# EAGLE design Robot_HC-SR04v1 (EAGLE 6.4)
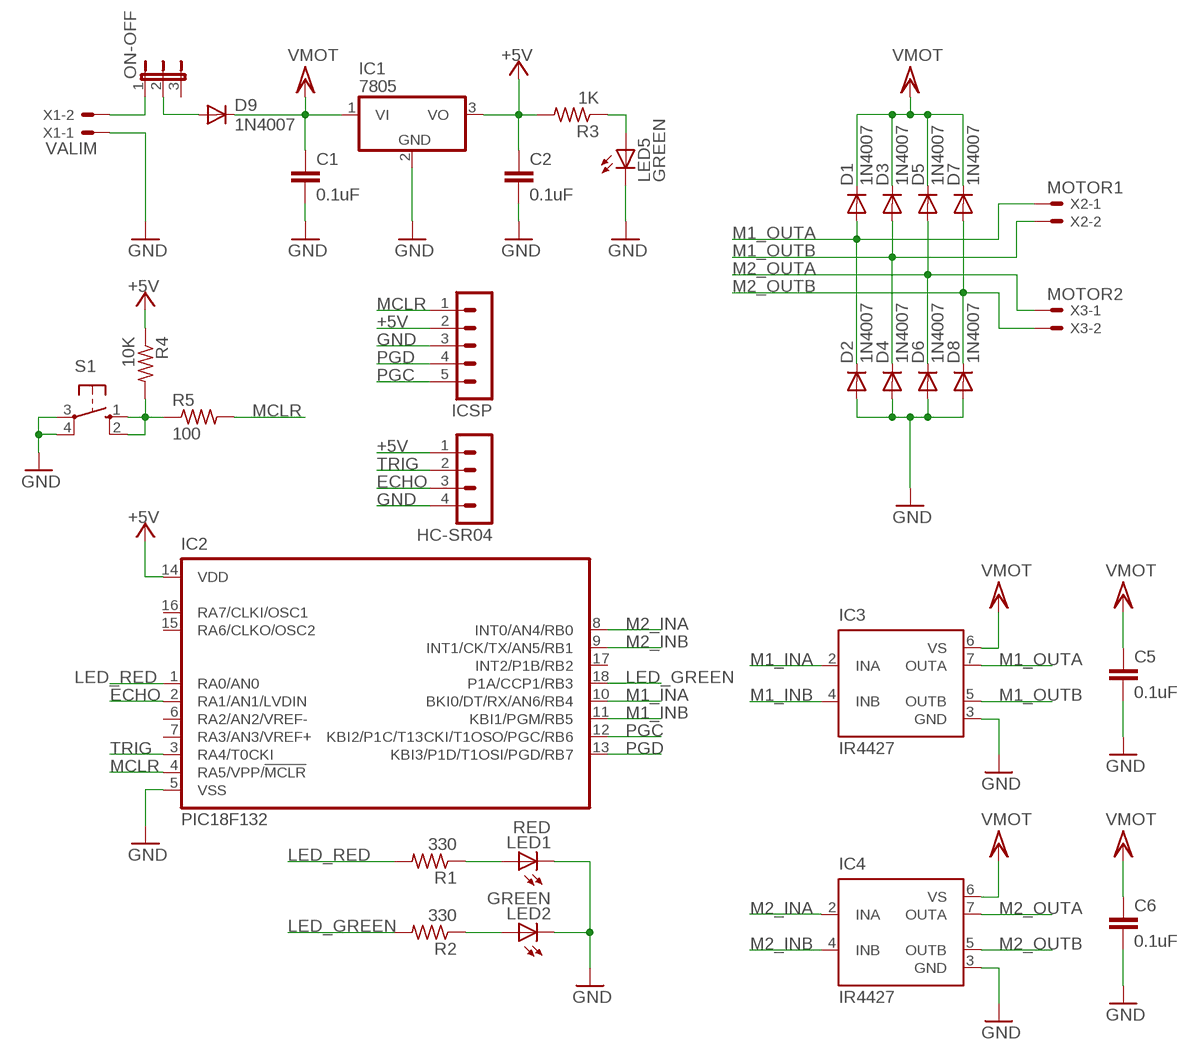
[diagram p0: schematic, sheet 1]

## Parts
C1  0.1uF  C-EU050-024X044  [C050-024X044]
C2  0.1uF  C-EU050-024X044  [C050-024X044]
C5  0.1uF  C-EU050-024X044  [C050-024X044]
C6  0.1uF  C-EU050-024X044  [C050-024X044]
D1  1N4007  1N4004  [DO41-10]
D2  1N4007  1N4004  [DO41-10]
D3  1N4007  1N4004  [DO41-10]
D4  1N4007  1N4004  [DO41-10]
D5  1N4007  1N4004  [DO41-10]
D6  1N4007  1N4004  [DO41-10]
D7  1N4007  1N4004  [DO41-10]
D8  1N4007  1N4004  [DO41-10]
D9  1N4007  1N4004  [DO41-10]
HC-SR04  MA04-1  [MA04-1]
IC1  7805  7805T  [TO220H]
IC2  PIC18F132  PIC18F1320SO  [SO-18W]
IC3  IR4427  [DIL08]
IC4  IR4427  [DIL08]
ICSP  MA05-1  [MA05-1]
LED1  RED  LED3MM  [LED3MM]
LED2  GREEN  LED3MM  [LED3MM]
LED5  GREEN  LED3MM  [LED3MM]
ON-OFF  JP2E  [JP2]
R1  330  R-US_0207/7  [0207/7]
R2  330  R-US_0207/7  [0207/7]
R3  1K  R-US_0207/7  [0207/7]
R4  10K  R-US_0207/7  [0207/7]
R5  100  R-US_0207/7  [0207/7]
S1  10-XX  [B3F-10XX]
X1  VALIM  22-23-2021  [22-23-2021]
X2  MOTOR1  22-23-2021  [22-23-2021]
X3  MOTOR2  22-23-2021  [22-23-2021]

## Nets
+5V: C2.1 HC-SR04.1 IC1.3(VO) IC2.14(VDD) ICSP.2 R3.2 R4.1
ECHO: HC-SR04.3 IC2.2(RA1/AN1/LVDIN)
GND: C1.2 C2.2 C5.2 C6.2 D2.A D4.A D6.A D8.A HC-SR04.4 IC1.2(GND) IC2.5(VSS) IC3.3(GND) IC4.3(GND) ICSP.3 LED1.K(C) LED2.K(C) LED5.K(C) S1.3(P) S1.4(P1) X1.1
LED_GREEN: IC2.18(P1A/CCP1/RB3) R2.2
LED_RED: IC2.1(RA0/AN0) R1.2
M1_INA: IC2.10(BKI0/DT/RX/AN6/RB4) IC3.2(INA)
M1_INB: IC2.11(KBI1/PGM/RB5) IC3.4(INB)
M1_OUTA: D1.A D2.C IC3.7(OUTA) X2.1
M1_OUTB: D3.A D4.C IC3.5(OUTB) X2.2
M2_INA: IC2.8(INT0/AN4/RB0) IC4.2(INA)
M2_INB: IC2.9(INT1/CK/TX/AN5/RB1) IC4.4(INB)
M2_OUTA: D5.A D6.C IC4.7(OUTA) X3.1
M2_OUTB: D7.A D8.C IC4.5(OUTB) X3.2
MCLR: IC2.4(RA5/VPP/!MCLR) ICSP.1 R5.2
N$1: LED5.A R3.1
N$2: R4.2 R5.1 S1.1(S) S1.2(S1)
N$3: D9.A ON-OFF.2
N$4: ON-OFF.1 X1.2
N$9: LED1.A R1.1
N$10: LED2.A R2.1
PGC: IC2.12(KBI2/P1C/T13CKI/T1OSO/PGC/RB6) ICSP.5
PGD: IC2.13(KBI3/P1D/T1OSI/PGD/RB7) ICSP.4
TRIG: HC-SR04.2 IC2.3(RA4/T0CKI)
VCC/2: C1.1 C5.1 C6.1 D1.C D3.C D5.C D7.C D9.C IC1.1(VI) IC3.6(VS) IC4.6(VS) ; supply symbol labelled VMOT
Unconnected: IC2.6(RA2/AN2/VREF-) IC2.7(RA3/AN3/VREF+) IC2.15(RA6/CLKO/OSC2) IC2.16(RA7/CLKI/OSC1) IC2.17(INT2/P1B/RB2) ON-OFF.3

## Library data of the parts
C1 C2 C5 C6 = rcl:C-EU: CAPACITOR, European symbol
D1-D9 = diode:1N4004: DIODE general purpose rectifier, 1 A
HC-SR04 = con-lstb:MA04-1: PIN HEADER; OC_FARNELL: unknown; OC_NEWARK: unknown
IC1 = linear:78*: Positive VOLTAGE REGULATOR Source: http://cache.national.com/ds/LM/LM78L05.pdf http://www.fairchildsemi.com/ds/LM/LM7805.pdf
IC2 = 1 MrChunckuee:PIC18F1320: 18/20/28-Pin High-Performance, Enhanced Flash Microcontrollers with 10-bit A/D and nanoWatt Technology
IC3 IC4 = 1 MrChunckuee:IR4427: DUAL LOW SIDE DRIVER Source: ID4427.pdf
ICSP = con-lstb:MA05-1: PIN HEADER; OC_FARNELL: unknown; OC_NEWARK: unknown
LED1 LED2 LED5 = led:LED: LED OSRAM: - CHIPLED LG R971, LG N971, LY N971, LG Q971, LY Q971, LO R971, LY R971 LH N974, LH R974 LS Q976, LO Q976, LY Q976 LO Q996 - Hyper CHIPLED LW Q18S LB Q993, LB Q99A, LB R99A - SideLED LS A670, LO A670, LY A670, LG A670, LP A670 LB A673, LV A673, LT A673, LW A673 LH A674 LY A675 LS A676, LA A676, LO A676, LY A676, LW A676 LS A679, LY A679, LG A679 - Hyper Micro SIDELED® LS Y876, LA Y876, LO Y876, LY Y876 LT Y87S - SmartLED LW L88C, LW L88S LB L89C, LB L89S, LG L890 LS L89K, LO L89K, LY L89K LS L896, LA L896, LO L896, LY L896 - TOPLED LS T670, LO T670, LY T670, LG T670, LP T670 LSG T670, LSP T670, LSY T670, LOP T670, LYG T670 LG T671, LOG T671, LSG T671 LB T673, LV T673, LT T673, LW T673 LH T674 LS T676, LA T676, LO T676, LY T676, LB T676, LH T676, LSB T676, LW T676 LB T67C, LV T67C, LT T67C, LS T67K, LO T67K, LY T67K, LW E67C LS E67B, LA E67B, LO E67B, LY E67B, LB E67C, LV E67C, LT E67C LW T67C LS T679, LY T679, LG T679 LS T770, LO T770, LY T770, LG T770, LP T770 LB T773, LV T773, LT T773, LW T773 LH T774 LS E675, LA E675, LY E675, LS T675 LS T776, LA T776, LO T776, LY T776, LB T776 LHGB T686 LT T68C, LB T68C - Hyper Mini TOPLED® LB M676 - Mini TOPLED Santana® LG M470 LS M47K, LO M47K, LY M47K Source: http://www.osram.convergy.de LUXEON: - LUMILED® LXK2-PW12-R00, LXK2-PW12-S00, LXK2-PW14-U00, LXK2-PW14-V00 LXK2-PM12-R00, LXK2-PM12-S00, LXK2-PM14-U00 LXK2-PE12-Q00, LXK2-PE12-R00, LXK2-PE12-S00, LXK2-PE14-T00, LXK2-PE14-U00 LXK2-PB12-K00, LXK2-PB12-L00, LXK2-PB12-M00, LXK2-PB14-N00, LXK2-PB14-P00, LXK2-PB14-Q00 LXK2-PR12-L00, LXK2-PR12-M00, LXK2-PR14-Q00, LXK2-PR14-R00 LXK2-PD12-Q00, LXK2-PD12-R00, LXK2-PD12-S00 LXK2-PH12-R00, LXK2-PH12-S00 LXK2-PL12-P00, LXK2-PL12-Q00, LXK2-PL12-R00 Source: www.luxeon.com KINGBRIGHT: KA-3528ASYC Source: www.kingbright.com
ON-OFF = jumper:JP2E: JUMPER
R1-R5 = rcl:R-US_: RESISTOR, American symbol
S1 = switch-omron:10-XX: OMRON SWITCH; MPN: B3F-1000; OC_FARNELL: 176432; OC_NEWARK: 36M3542
X1-X3 = con-molex:22-23-2021: .100" (2.54mm) Center Header - 2 Pin; MF: MOLEX; MPN: 22-23-2021; OC_FARNELL: 1462926; OC_NEWARK: 25C3832

## Board
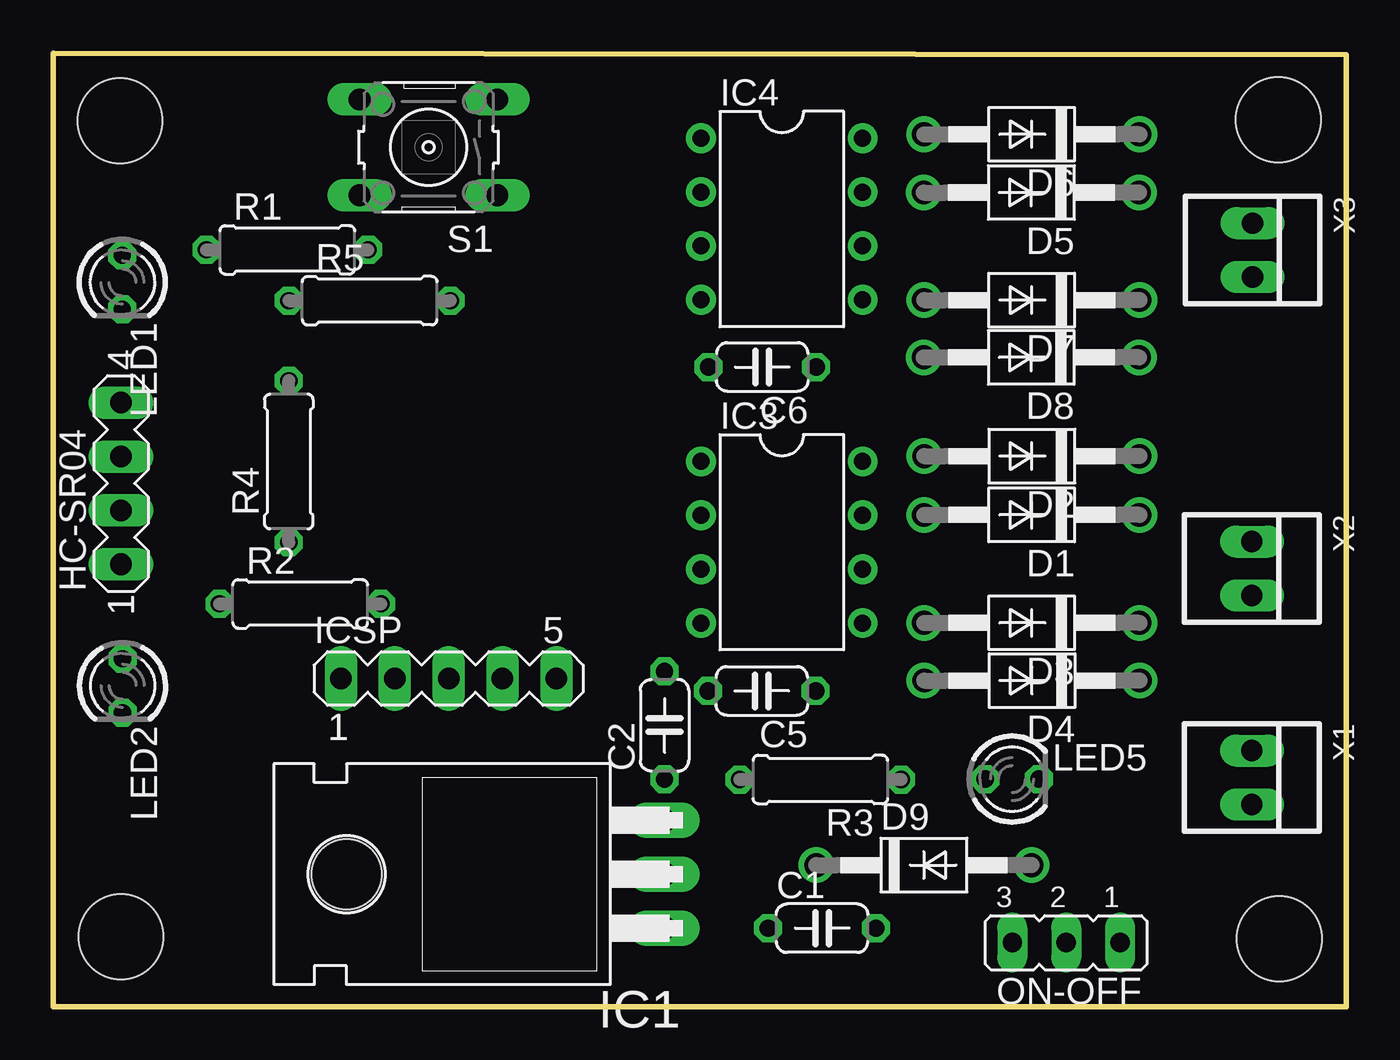
[diagram p1: board, top side]
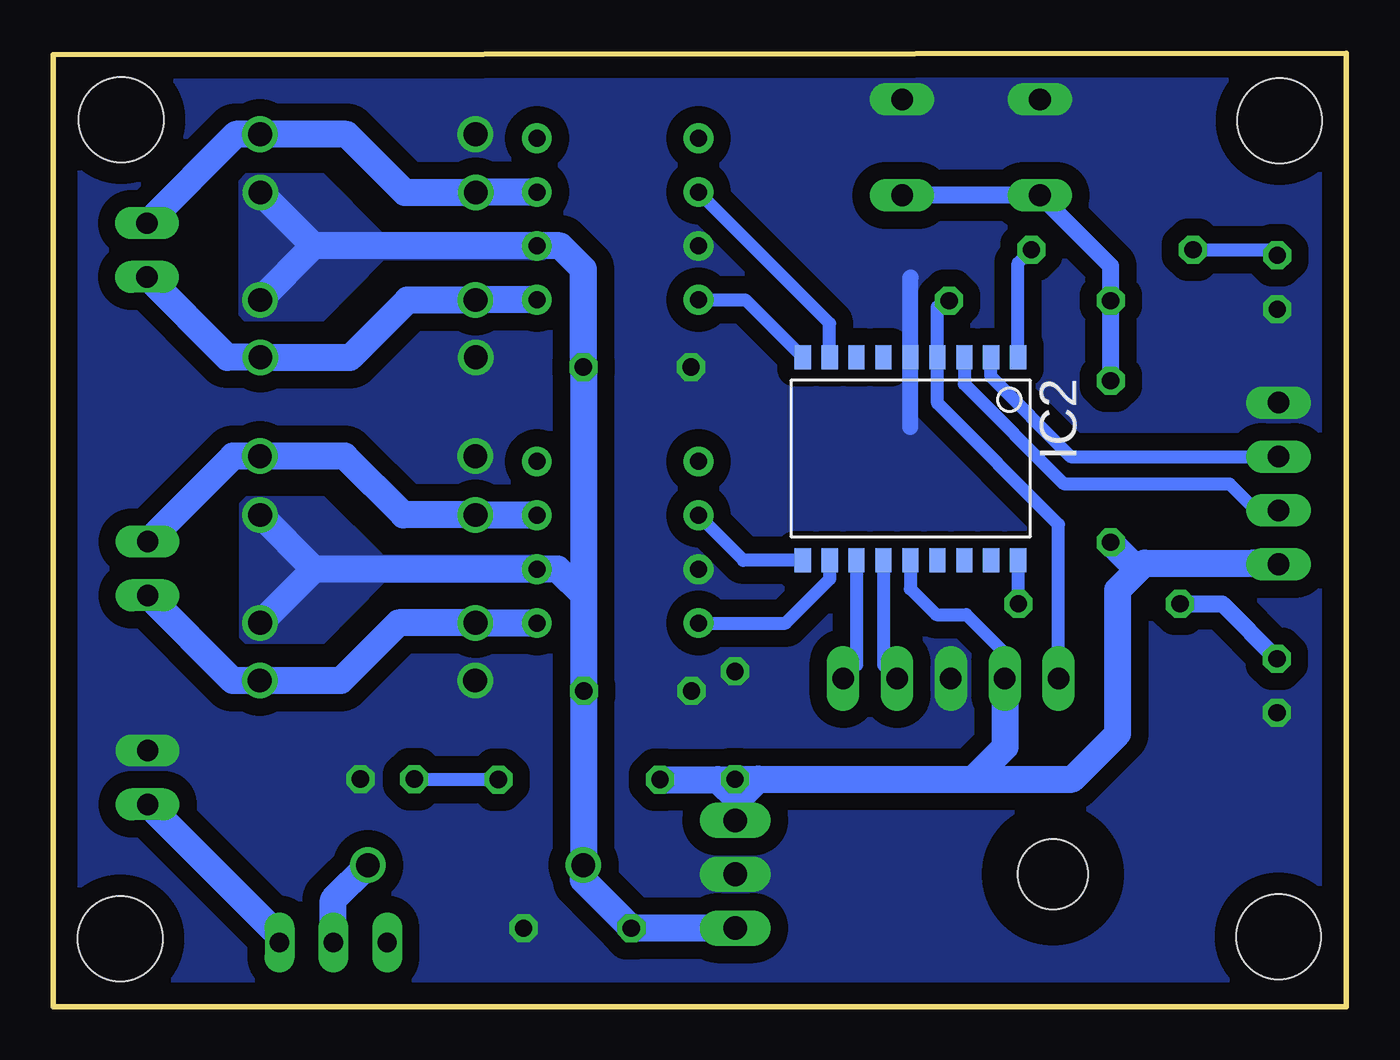
[diagram p2: board, bottom side, seen from below]

Size 61.01 x 44.98 mm. Coordinates in mm from the lower left corner, seen from the top.
Outline: 0,0 61.01,0.02 61.01,44.89 0,44.98 0,0
Copper layers (1*16): Top 0.035mm / dielectric 1.5mm / Bottom 0.035mm
Design rules "default": minimum track width 10mil, minimum drill 24mil, track to track 8mil, track to pad 8mil, pad to pad 8mil, via to via 8mil, smd to smd 8mil, copper to edge 40mil, drill to drill 8mil, minimum pad ring 10mil, minimum via ring 8mil, stop-mask expansion 4mil, vias tented up to drill 0mil, thermal gap 10mil
Holes 4 mm at 57.78,41.84 57.85,3.21 3.2,3.31 3.16,41.79

### Footprints (pad centres in the part's own frame; a part is rotated, then mirrored left to right if it is on the bottom)
C050-024X044 = drill 0.813 octagon: 1 -2.54,0; 2 2.54,0
DO41-10 = drill 1.118: A 5.08,0; C -5.08,0
MA04-1 = drill 1.016 long: 1 -3.81,0; 2 -1.27,0; 3 1.27,0; 4 3.81,0
TO220H = drill 1.118 long: 1 -2.54,-10.16; 2 0,-10.16; 3 2.54,-10.16 | hole 3.302: 0,4.826
SO-18W = smd 0.762 x 1.143: 1 -5.08,-4.788; 2 -3.81,-4.788; 3 -2.54,-4.788; 4 -1.27,-4.788; 5 0,-4.788; 6 1.27,-4.788; 7 2.54,-4.788; 8 3.81,-4.788; 9 5.08,-4.788; 10 5.08,4.788; 11 3.81,4.788; 12 2.54,4.788; 13 1.27,4.788; 14 0,4.788; 15 -1.27,4.788; 16 -2.54,4.788; 17 -3.81,4.788; 18 -5.08,4.788
DIL08 = drill 0.8 pad 1.4: 1 -3.81,-3.81; 2 -1.27,-3.81; 3 1.27,-3.81; 4 3.81,-3.81; 5 3.81,3.81; 6 1.27,3.81; 7 -1.27,3.81; 8 -3.81,3.81
MA05-1 = drill 1.016 long: 1 -5.08,0; 2 -2.54,0; 3 0,0; 4 2.54,0; 5 5.08,0
LED3MM = drill 0.813 octagon: A -1.27,0; K 1.27,0
JP2 = drill 0.914 long: 1 -2.54,0; 2 0,0; 3 2.54,0
0207/7 = drill 0.813 octagon: 1 -3.81,0; 2 3.81,0
B3F-10XX = drill 1.016 long: 1 -3.251,2.261; 2 3.251,2.261; 3 -3.251,-2.261; 4 3.251,-2.261
22-23-2021 = drill 1 long: 1 -1.27,0; 2 1.27,0

### Placement (x,y rotation side)
C1  36.27,3.71 0 top
C2  28.84,13.28 90 top
C5  33.43,14.9 180 top
C6  33.45,30.17 180 top
D1  46.16,23.2 180 top
D2  46.17,25.97 180 top
D3  46.16,18.11 180 top
D4  46.18,15.39 180 top
D5  46.15,38.4 180 top
D6  46.16,41.15 180 top
D7  46.16,33.33 180 top
D8  46.14,30.63 180 top
D9  41.07,6.69 0 top
HC-SR04  3.21,24.68 90 top
IC1  18.67,6.26 90 top
IC2  20.57,25.85 180 bottom
IC3  34.37,21.91 270 top
IC4  34.37,37.15 270 top
ICSP  18.66,15.48 0 top
LED1  3.27,34.17 270 top
LED2  3.28,15.15 270 top
LED5  45.24,10.75 0 top
ON-OFF  47.79,3.03 180 top
R1  11.05,35.7 0 top
R2  11.66,19.01 0 top
R3  36.19,10.72 180 top
R4  11.12,25.72 90 top
R5  14.93,33.3 0 top
S1  17.71,40.53 180 top
X1  56.54,10.82 270 top
X2  56.54,20.67 270 top
X3  56.57,35.69 270 top

### Tracks (layer width: path | path; a pad name or v marks a point on that pad's centre or on a via)
+5V
  Bottom 0.61: IC2.14 20.57,19.72 19.35,18.5 17.93,18.5 16.1,16.68 16.1,15.5 ICSP.2
  Bottom 1.27: C2.1 27.74,10.74 | 27.74,10.74 17.62,10.74 | 17.62,10.74 12.94,10.74 10.79,12.89 10.79,19.67 9.84,20.61 | 9.84,20.61 9.53,20.93 4.42,20.93 HC-SR04.1 | 16.1,15.5 16.1,12.25 17.62,10.74 | R4.1 11.12,21.89 9.84,20.61 | 28.83,10.73 C2.1 | IC1.3 28.83,9.65 28.71,9.77 | 28.71,9.77 27.74,10.74 | 29.66,10.72 28.71,9.77 | R3.2 28.86,10.72 C2.1
ECHO
  Bottom 0.61: HC-SR04.3 13.01,25.95 16.77,29.71 16.77,30.62 IC2.2
GND
  Bottom 0.762: IC2.5 20.57,34.38 20.56,34.38 | 20.57,27.35 20.57,30.66 20.59,30.68 20.59,30.66
  pour Bottom (isolate 0.813, no thermals): -1.36,45.73 62.14,45.73 62.14,-1.26 -1.36,-1.26
LED_GREEN
  Bottom 0.61: IC2.18 15.49,19.02 R2.2
LED_RED
  Bottom 0.61: IC2.1 15.49,35.07 R1.2
M1_INA
  Bottom 0.61: IC2.10 28.44,21.06 IC3.2
M1_INB
  Bottom 0.61: IC3.4 26.45,18.1 24.37,20.19 24.37,21.05 IC2.11
M1_OUTA
  Bottom 1.27: IC3.7 41.06,23.18 D1.A 44.48,23.2 47.25,25.97 D2.C 52.52,25.97 X2.1
M1_OUTB
  Bottom 1.27: IC3.5 41.07,18.1 D3.A 44.71,18.11 47.43,15.39 D4.C 52.53,15.39 X2.2
M2_INA
  Bottom 0.61: IC2.8 24.38,32.23 IC4.2
M2_INB
  Bottom 0.61: IC4.4 28.35,33.34 IC2.9
M2_OUTA
  Bottom 1.27: IC4.7 41.04,38.42 D5.A 44.41,38.4 47.16,41.15 D6.C | D6.C | D6.C 52.39,41.15 X3.1
M2_OUTB
  Bottom 1.27: IC4.5 41.07,33.34 D7.A 44.29,33.33 47,30.62 51.21,30.62 D8.C 52.79,30.63 X3.2
MCLR
  Bottom 0.61: ICSP.1 13.58,22.74 19.29,28.45 IC2.4 19.3,33 R5.2
N$1
  Bottom 0.61: R3.1 43.94,10.72 LED5.A
N$2
  Bottom 0.813: R4.2 R5.1 11.12,34.93 S1.2 S1.1
N$3
  Bottom 1.27: ON-OFF.2 47.79,5.05 D9.A
N$4
  Bottom 1.27: ON-OFF.1 50.33,3.33 X1.2
N$9
  Bottom 0.61: R1.1 3.53,35.7 LED1.A
N$10
  Bottom 0.813: R2.1 5.87,19.01 LED2.A
PGC
  Bottom 0.61: IC2.12 23.11,16.12 ICSP.5
PGD
  Bottom 0.61: IC2.13 21.84,16.12 ICSP.4
TRIG
  Bottom 0.61: IC2.3 18.03,29.37 13.3,24.65 5.51,24.65 4.29,23.43 3.23,23.43 HC-SR04.2
VCC/2
  Bottom 1.27: 35.99,19.43 C6.1 35.99,34.79 37.08,35.88 IC4.6 48.71,35.88 | 35.99,19.43 35.99,14.92 | 35.99,14.92 C5.1 | 35.99,19.43 37.21,20.64 IC3.6 48.68,20.64 | 35.99,14.92 D9.C | D9.C | D9.C 35.99,5.98 C1.1 IC1.1 | 48.71,35.88 D5.C | D7.C 51.24,33.35 48.71,35.88 | 48.68,20.64 D1.C | D3.C 51.21,18.11 48.68,20.64
  pour Bottom (no thermals): 38.21,21.32 45.45,21.32 48.21,24.09 51.89,24.09 52.22,23.75 52.22,17.4 51.95,17.13 48.21,17.13 45.38,20 37.79,20 37.73,20.01
  pour Bottom (no thermals): 38.25,36.54 45.48,36.54 48.25,39.3 51.92,39.3 52.26,38.97 52.26,32.62 51.98,32.34 48.25,32.34 45.42,35.21 37.83,35.21 37.77,35.23